# Altium project Clap_activated_light.PrjPcb
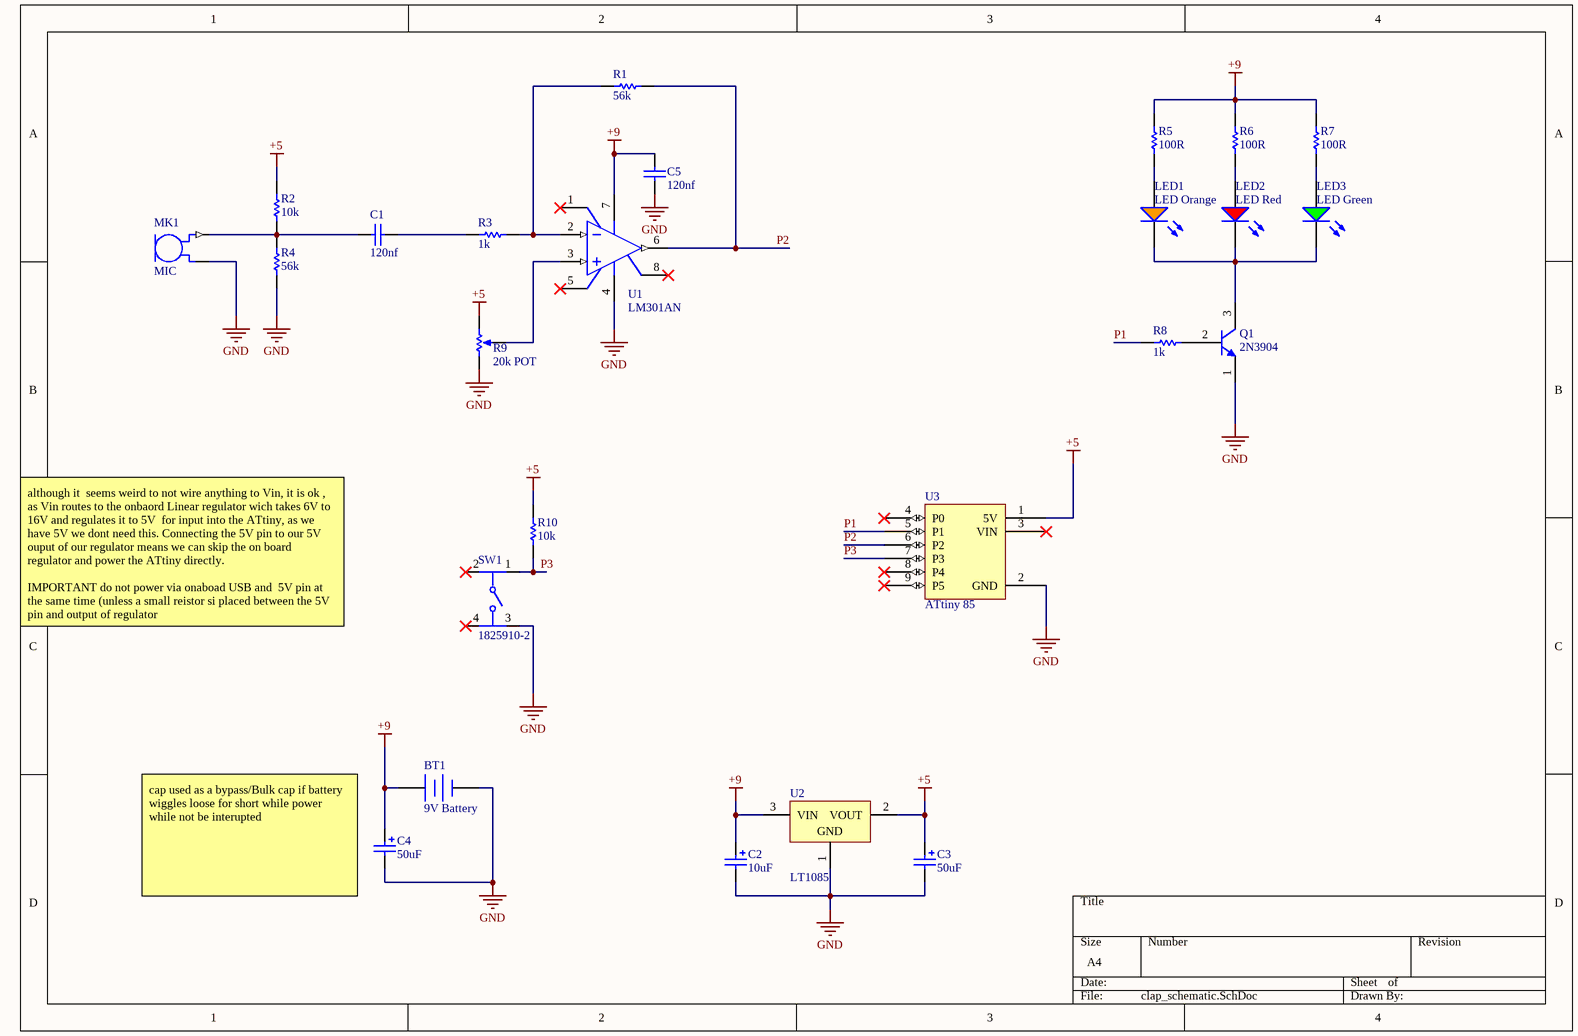
[diagram p0: clap_schematic.SchDoc]
1 sheet, 25 parts. Net scope: global (net labels, ports and power ports of the same name join across sheets).
Board files: clap_PCB.PcbDoc, clap_button_PCB.PcbDoc

## Sheet clap_schematic.SchDoc
size A4; SheetNumber: 1; SheetTotal: 1; SPICEModelCacheIXIBNOEF: <root> / <DocumentId>IXIBNOEF</DocumentId> / </root>

### Parts
BT1  9V Battery  [Battery]
C1  120nf  [C322C334M5U5TA7301]
C2  10uF  [Ecap_Axial_2mm_5mm]
C3  50uF  [Ecap_Axial_2mm_6.5mm]
C4  50uF  [Ecap_Axial_2mm_6.5mm]
C5  120nf  [C322C334M5U5TA7301]
LED1  LED Orange  [LED 3D]
LED2  LED Red  [LED 3D]
LED3  LED Green  [LED 3D]
MK1  MIC  [MIC]
Q1  2N3904  [2N3904 (straight)]
R1  56k  [Res through hole]
R2  10k  [Res through hole]
R3  1k  [Res through hole]
R4  56k  [Res through hole]
R5  100R  [Res through hole]
R6  100R  [Res through hole]
R7  100R  [Res through hole]
R8  1k  [Res through hole]
R9  20k POT  [TRIM_3296W-1-203RLF]
R10  10k  [Res through hole]
SW1  1825910-2  [FP-1825910-2-0]
U1  LM301AN  [LM301AN]
U2  LT1085  [LT1085 (TO220)]
U3  ATtiny 85  [Disgispark ATtiny 85]

### Nets
+5: C3.1 R2.2 R9.3(BOT) R10.2 U2.2(VOUT) U3.1(5V)
+9: BT1.1(+) C2.1 C4.1 C5.2 R5.2 R6.2 R7.2 U1.7(V+) U2.3(VIN)
GND: BT1.2(-) C2.2 C3.2 C4.2 C5.1 MK1.2(GND) Q1.1(E) R4.1 R9.1(TOP) SW1.3 U1.4(V-) U2.1(GND) U3.2(GND)
P1: R8.1 U3.5(P1)
P2: R1.1 U1.6(OUT) U3.6(P2)
P3: R10.1 SW1.1 U3.7(P3)
NetC1_1: C1.1 MK1.1(OUT) R2.1 R4.2
NetC1_2: C1.2 R3.1
NetLED1_1: LED1.1(A) R5.1
NetLED1_2: LED1.2(K) LED2.2(K) LED3.2(K) Q1.3(C)
NetLED2_1: LED2.1(A) R6.1
NetLED3_1: LED3.1(A) R7.1
NetQ1_2: Q1.2(B) R8.2
NetR1_2: R1.2 R3.2 U1.2(IN-)
NetR9_2: R9.2(TAP) U1.3(IN+)

Not connected (* = marked no-connect by the designer): SW1 2* 4*; U1 1(BAL/COMP)* 5(BAL)* 8(COMP)*; U3 3(VIN)* 4(P0)* 8(P4)* 9(P5)*

### Notes on the sheet
- although it  seems weird to not wire anything to Vin, it is ok , as Vin routes to the onbaord Linear regulator wich takes 6V to 16V and regulates it to 5V  for input into the ATtiny, as we have 5V we dont need this. Connecting the 5V pin to our 5V ouput of our regulator means we can skip the on board regulator and power the ATtiny directly.
  IMPORTANT do not power via onaboad USB and  5V pin at the same time (unless a small reistor si placed between the 5V pin and output of regulator
- (near C4) cap used as a bypass/Bulk cap if battery wiggles loose for short while power while not be interupted

### Library data of the parts
C1 C5 = 120nF: 120nF Capacitor; Published: 8-Jun-2000; LatestRevisionDate: 17-Jul-2002; LatestRevisionNote: Re-released for DXP Platform.; PackageReference: RAD-0.3; Publisher: Altium Limited; PackageDescription: Radial Cap, Thru-Hole; 2 Leads; 0.3 in Pin Spacing
C2 = 10uF: 10uF electrolytic capacitor; Published: 8-Jun-2000; LatestRevisionDate: 29-May-2009; LatestRevisionNote: IPC-7351 Footprint Added.; PackageReference: C0805; Publisher: Altium Limited; PackageDescription: Chip Capacitor
C3 C4 = 50uF: 50uF electrolytic capacitor; Published: 8-Jun-2000; LatestRevisionDate: 29-May-2009; LatestRevisionNote: IPC-7351 Footprint Added.; PackageReference: C0805; Publisher: Altium Limited; PackageDescription: Chip Capacitor
LED1 = LED Orange: Orange LED; Manufacturer: Vishay; Lum Intensity: 500mW/srmcd; Product Depth (mm): 5.8mm; Type: IrLED; Luminous Intensity: 500mW/sr; Chip Material: GaAlAs; Forward Voltage: 3V; Shape Type: Circular; Peak Wavelength: 950nm; Rad Hardened: No; Product Height (mm): 8.7mm; Number of  Elements: 1; Forward Current: 100mA; High Brightness: Yes; Reverse Voltage: 5V; DELETED: Compliant; Power Dissipation: 160W; Viewing Angle: 34deg; Lens Type: Colored; Packaging: Bulk; Lens Dimensions: 5x5x7.7mm; Package Reference: TSAL6200; Package Description: 2-Pin Through Hole Device, Dia 5.8 mm, Pitch 2.54 mm; Main Category: IrLED; Manufacturer URL: http://www.vishay.com/; Product Length (mm): 5.8mm; Datasheet URL: http://www.vishay.com/docs/81010/tsal6200.pdf; Operating Temperature Classification: Industrial; Package Type: T-13/4; Pin Count: 2; Mounting: ThroughHole; Mounting Technology: ThroughHole; Test Current (It): 100mA; Datasheet Version: Rev. 2.4, 03/2014; Operating Temp Range: -40Cto85C
LED2 = LED Red: Red LED; Manufacturer: Vishay; Lum Intensity: 500mW/srmcd; Product Depth (mm): 5.8mm; Type: IrLED; Luminous Intensity: 500mW/sr; Chip Material: GaAlAs; Forward Voltage: 3V; Shape Type: Circular; Peak Wavelength: 950nm; Rad Hardened: No; Product Height (mm): 8.7mm; Number of  Elements: 1; Forward Current: 100mA; High Brightness: Yes; Reverse Voltage: 5V; DELETED: Compliant; Power Dissipation: 160W; Viewing Angle: 34deg; Lens Type: Colored; Packaging: Bulk; Lens Dimensions: 5x5x7.7mm; Package Reference: TSAL6200; Package Description: 2-Pin Through Hole Device, Dia 5.8 mm, Pitch 2.54 mm; Main Category: IrLED; Manufacturer URL: http://www.vishay.com/; Product Length (mm): 5.8mm; Datasheet URL: http://www.vishay.com/docs/81010/tsal6200.pdf; Operating Temperature Classification: Industrial; Package Type: T-13/4; Pin Count: 2; Mounting: ThroughHole; Mounting Technology: ThroughHole; Test Current (It): 100mA; Datasheet Version: Rev. 2.4, 03/2014; Operating Temp Range: -40Cto85C
LED3 = LED Green: Green LED; Manufacturer: Vishay; Lum Intensity: 500mW/srmcd; Product Depth (mm): 5.8mm; Type: IrLED; Luminous Intensity: 500mW/sr; Chip Material: GaAlAs; Forward Voltage: 3V; Shape Type: Circular; Peak Wavelength: 950nm; Rad Hardened: No; Product Height (mm): 8.7mm; Number of  Elements: 1; Forward Current: 100mA; High Brightness: Yes; Reverse Voltage: 5V; DELETED: Compliant; Power Dissipation: 160W; Viewing Angle: 34deg; Lens Type: Colored; Packaging: Bulk; Lens Dimensions: 5x5x7.7mm; Package Reference: TSAL6200; Package Description: 2-Pin Through Hole Device, Dia 5.8 mm, Pitch 2.54 mm; Main Category: IrLED; Manufacturer URL: http://www.vishay.com/; Product Length (mm): 5.8mm; Datasheet URL: http://www.vishay.com/docs/81010/tsal6200.pdf; Operating Temperature Classification: Industrial; Package Type: T-13/4; Pin Count: 2; Mounting: ThroughHole; Mounting Technology: ThroughHole; Test Current (It): 100mA; Datasheet Version: Rev. 2.4, 03/2014; Operating Temp Range: -40Cto85C
MK1 = MIC: CMA Series 9.7 mm Electret Condenser Omni-Directional Pin Mount 3 V Microphone; MP: CMA-4544PF-W; Package: None; Availability: Unavailable; Value: *; Price: None
Q1 = 2N3904: 2N3904 NPN General-Purpose Amplifier, 40 V VCEO, 0.2 A, -55 to 150 degC, 2-Pin TO-92, RoHS, Bulk; Manufacturer: FairchildSemiconductor; Maximum Collector Base Voltage: 60V; Minimum DC Current Gain: 40@0.1mA@1V|70@1mA@1V|100@10mA@1V|60@50mA@1V|30@100mA@1V; Maximum Collector Emitter Voltage: 40V; Maximum DC Collector Current: 0.2A; Rad Hard: No; Maximum Operating Frequency: 300(Min)MHz; Maximum Collector Emitter Saturation Voltage: 0.2@1mA@10mA|0.3@5mA@50mAV; Maximum Power Dissipation: 625mW; Package Description: 3-Pin Transistor Outline Package, Body Dia 4.79 mm, Pitch 1.27 mm; Package Reference: TO-92; Pin Count: 3; Operating Temperature: -55to150degC; Category: GPBJT; Manufacturer URL: https://www.fairchildsemi.com/; Datasheet URL: https://datasheet.ciiva.com/4722/2n3904-82270-4722369.pdf; Package: 3TO-92; Packaging: Bulk; Type: NPN; Datasheet Version: Rev. 1.1.0, 10/2014; Mounting: ThroughHole
R1 R4 = 56k: 56k Resistor; Published: 8-Jun-2000; LatestRevisionDate: 17-Jul-2002; LatestRevisionNote: Re-released for DXP Platform.; PackageReference: AXIAL-0.3; Publisher: Altium Limited; PackageDescription: Axial Device, Thru-Hole; 2 Leads; 0.3 in Pin Spacing
R2 R10 = 10k: 10k Resistor; Published: 8-Jun-2000; LatestRevisionDate: 17-Jul-2002; LatestRevisionNote: Re-released for DXP Platform.; PackageReference: AXIAL-0.3; Publisher: Altium Limited; PackageDescription: Axial Device, Thru-Hole; 2 Leads; 0.3 in Pin Spacing
R3 R8 = 1k: 1k Resistor; Published: 8-Jun-2000; LatestRevisionDate: 17-Jul-2002; LatestRevisionNote: Re-released for DXP Platform.; PackageReference: AXIAL-0.3; Publisher: Altium Limited; PackageDescription: Axial Device, Thru-Hole; 2 Leads; 0.3 in Pin Spacing
R5-R7 = 100R: Resistor; Published: 8-Jun-2000; LatestRevisionDate: 17-Jul-2002; LatestRevisionNote: Re-released for DXP Platform.; PackageReference: AXIAL-0.3; Publisher: Altium Limited; PackageDescription: Axial Device, Thru-Hole; 2 Leads; 0.3 in Pin Spacing
R9 = 20k POT: 20k Potentiometer; Sim Note: Enter the Resistance value and the set point into parameter fields.; Set Position: 0.5; Published: 8-Jun-2000; LatestRevisionDate: 17-Jul-2002; LatestRevisionNote: Re-released for DXP Platform.; PackageReference: VR5; Publisher: Altium Limited; PackageDescription: Variable Resistor, Thru-Hole; 3 Leads
SW1 = CMP-03407-000004-1: SWITCH TACTILE SPST-NO 0.05A 24V; Manufacturer: TE; Contact Current Rating: 50mA; Description: Switch Tactile Round Button PC Pins 0.05A 24VDC 100000Cycle 1.56N Thru-Hole; Operating Force: 160gf; Contact Resistance: 100mΩ; Electromechanical Life: 100000Cycles; Package: 0; ComponentLink2Description: Datasheet; Digikey Description: SWITCH TACTILE SPST-NO 0.05A 24V; Octopart: https://octopart.com/1825910-2-te+connectivity-42270502; Temperature Range Low: -35°C; Temperature Range High: +85°C; Lead Free: Yes; Device Class L2: Switches; Automotive: No; Temperature: -35°C to +85°C; Device Class L1: Electromechanical; Category: Switch; ComponentLink2URL: https://www.te.com/commerce/DocumentDelivery/DDEController?Action=showdoc&DocId=Customer+Drawing%7F1825910%7FC10%7Fpdf%7FEnglish%7FENG_CD_1825910_C10.pdf%7F1825910-2; Mount: Through Hole; RoHS: TRUE; Height: 4.6mm; Manufacturer Part Number: 1825910-2; Device Class L3: Tactile Switches; Voltage Rating Dc: 24V; Throw Configuration: SPST-NO
U1 = LM301AN: Operational Amplifier, 8-pin MDIP; Manufacturer: National Semiconductor; PackageTopMarking: NSUZXYTTE#*LM*301AN; PowerWise: N; CompType: Amplifiers; PackageVersion: revG, May-2006; DatasheetVersion: Aug-2000; PinCount: 8; ComponentLink3Description: N08E Package Page; Code_JEDEC: MS-001-BA; ComponentLink1Description: LM301A Datasheet; ComponentLink2Description: LM301A Web Page; PackageReference: N08E; PackageDescription: MDIP, .365 x .250 x .130in, 8 Lead, .100in Pitch; ComponentLink3URL: http://www.national.com/packaging/folders/n08e.html; ComponentLink1URL: http://www.national.com/ds/LM/LM301A.pdf; RevisionNote: Component URLs added; RoHS: N; ComponentLink2URL: http://www.national.com/pf/LM/LM301A.html
U2 = LT1085: 3 A Low Dropout Positive Regulator, 4.3 to 25 V Vin, 3.3 V Vout, 3-pin FM (T-3), 0 to 150 degC, Pb-Free; Manufacturer: Linear Technology; PartNumber: LT1085CT-3.3#PBF; Vin Min(V): 4.3; Dropout Voltage(V): 1.3; Output Voltage: 3.3 V; Vin Max(V): 25; Number of Outputs: 1; Isupply(mA): 5; Discrete Pass Element: no; PSRR(dB): 72; Iout(mA): 3000; ComponentLink1URL: http://www.linear.com/; ComponentLink2Description: Datasheet; RoHS: TRUE; DatasheetVersion: Rev. D; Mounting Technology: Through Hole; ComponentLink3URL: http://cds.linear.com/docs/en/packaging/TO-220_3_05-08-1420.pdf; ComponentLink3Description: Package Specification; PackageDescription: 3-Pin Plastic TO-220, Body 10.2235 x 4.3815 mm, Pitch 2.54 mm; ComponentLink2URL: http://cds.linear.com/docs/en/datasheet/1083ffd.pdf; ComponentLink1Description: Manufacturer URL; PackageReference: T-3; PackageVersion: Jun-10
U3 = ATtiny 85: the mount for the digispark ATtiny 85 board
BT1 = 9V Battery: Published: 24-Mar-1999; LatestRevisionDate: 17-Jul-2002; LatestRevisionNote: Re-released for DXP Platform.; PackageReference: BAT-2; Publisher: Altium Limited; PackageDescription: Battery; 2 Leads